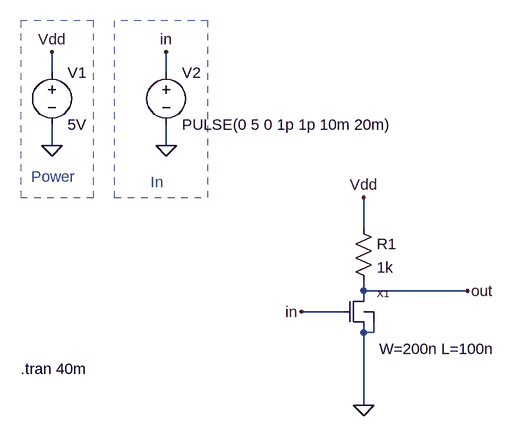
[diagram p0: schematic nmos_block.asc]
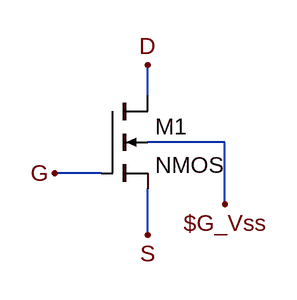
[diagram p1: sub-circuit nmos.asc]
nmos_block.asc, the LTspice schematic file:
Version 4
SHEET 1 880 680
WIRE -560 -416 -560 -448
WIRE -384 -416 -384 -448
WIRE -560 -304 -560 -336
WIRE -384 -304 -384 -336
WIRE -80 -176 -80 -224
WIRE -80 -80 -80 -96
WIRE 80 -80 -80 -80
WIRE -80 -64 -80 -80
WIRE -112 -48 -176 -48
WIRE -80 -16 -80 -32
WIRE -64 -16 -64 -32
WIRE -64 -16 -80 -16
WIRE -80 96 -80 -16
FLAG 80 -80 out
FLAG -176 -48 in
FLAG -80 -224 Vdd
FLAG -80 96 0
FLAG -560 -304 0
FLAG -560 -448 Vdd
FLAG -384 -304 0
FLAG -384 -448 in
SYMBOL voltage -560 -432 R0
WINDOW 123 0 0 Left 0
WINDOW 39 0 0 Left 0
SYMATTR InstName V1
SYMATTR Value 5V
SYMBOL voltage -384 -432 R0
WINDOW 123 0 0 Left 0
WINDOW 39 0 0 Left 0
SYMATTR InstName V2
SYMATTR Value PULSE(0 5 0 1p 1p 10m 20m)
SYMBOL res -96 -192 R0
SYMATTR InstName R1
SYMATTR Value 1k
SYMBOL nmos -112 -48 R0
WINDOW 39 56 57 Left 2
SYMATTR InstName X1
SYMATTR SpiceLine W=200n L=100n
TEXT -592 -256 Left 2 ;Power
TEXT -408 -248 Left 2 ;In
TEXT -608 40 Left 2 !.tran 40m
RECTANGLE Normal -496 -496 -608 -224 2
RECTANGLE Normal -320 -496 -464 -224 2

nmos.asc, the sub-circuit schematic file:
Version 4
SHEET 1 880 680
WIRE -80 -96 -80 -128
WIRE 0 -48 -80 -48
WIRE -128 -16 -176 -16
WIRE 0 16 0 -48
WIRE -80 48 -80 0
FLAG -176 -16 G
FLAG -80 48 S
FLAG -80 -128 D
FLAG 0 16 $G_Vss
SYMBOL nmos4 -128 -96 R0
SYMATTR InstName M1

The netlist it stands for:
* nmos_block.asc
V1 Vdd 0 5V
V2 in 0 PULSE(0 5 0 1p 1p 10m 20m)
R1 Vdd out 1k
XX1 in out 0 0 nmos params: W=200n L=100n

* block symbol definitions
.subckt nmos G D S Vss
M1 D G S $G_Vss NMOS
.ends nmos

.model NMOS NMOS
.model PMOS PMOS
.lib standard.mos
* Power
* In
.tran 40m
.backanno
.end